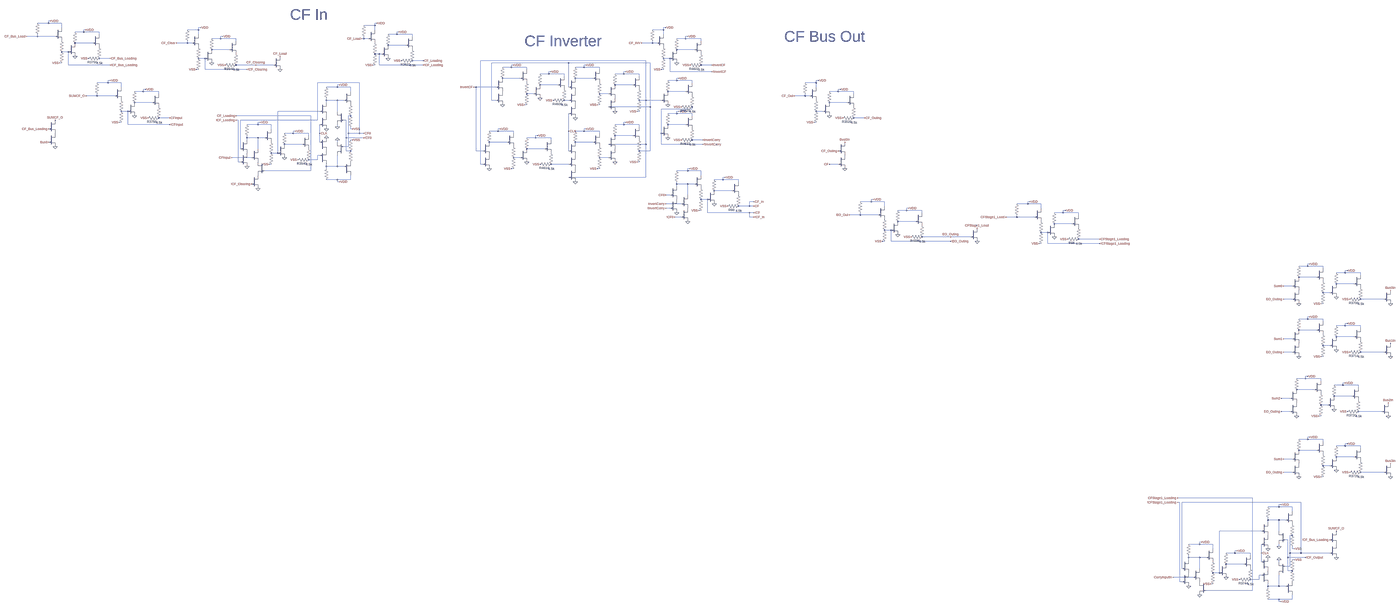
[diagram p0: schematic carry logic and bus outputting.asc, whole sheet]
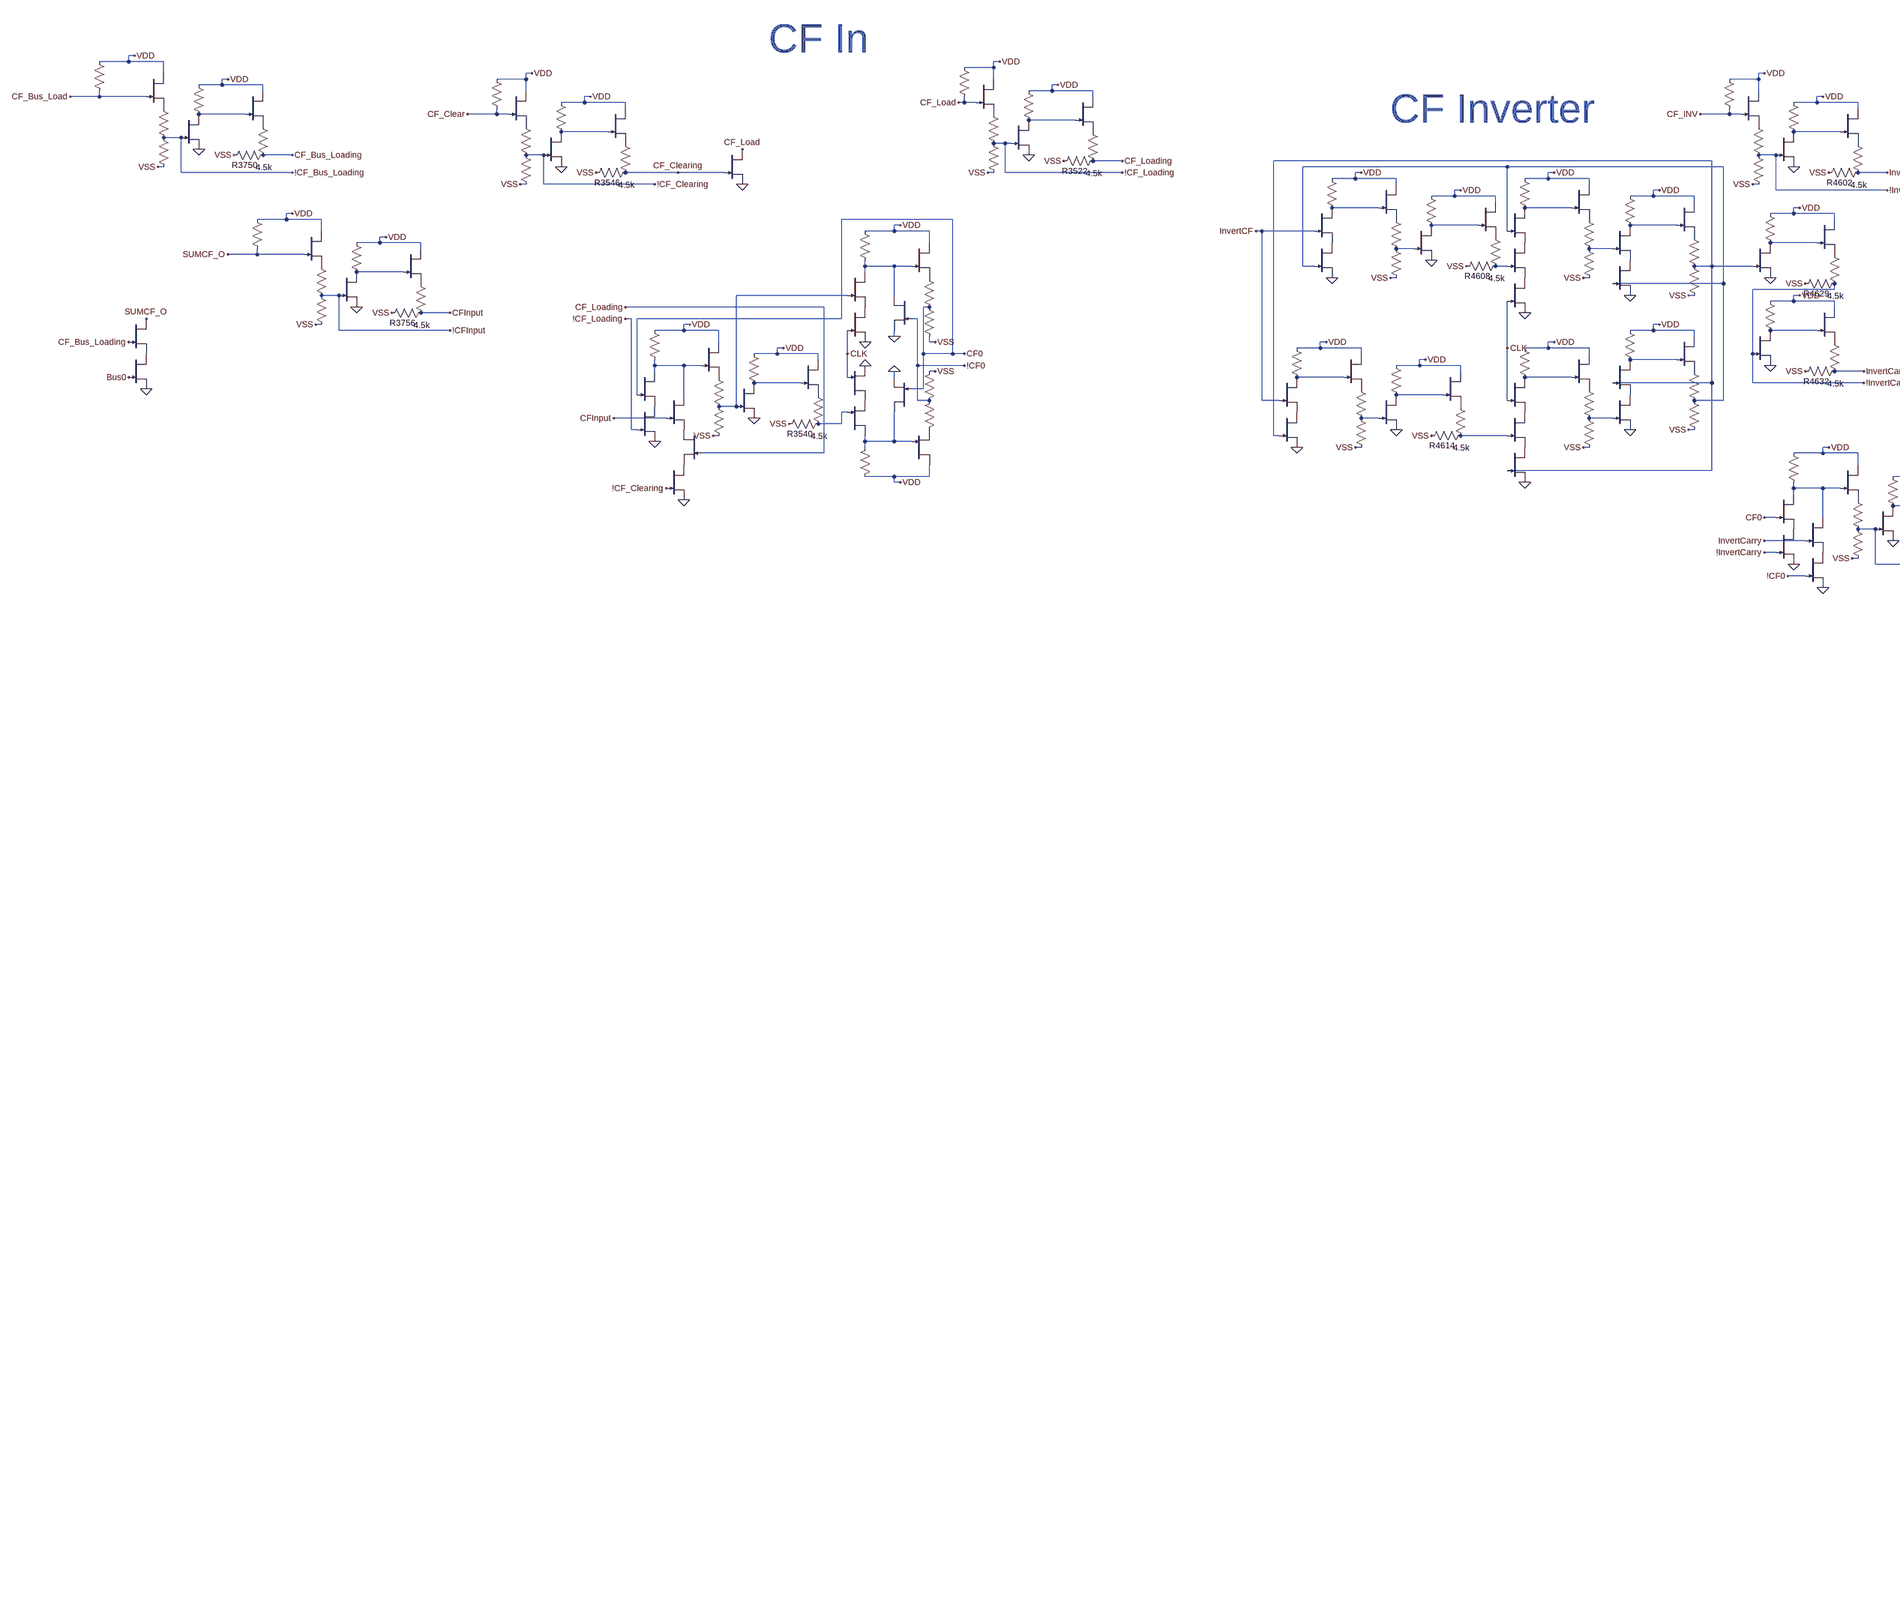
[diagram p1: schematic carry logic and bus outputting.asc, part, row 1 of 1, column 1 of 2]
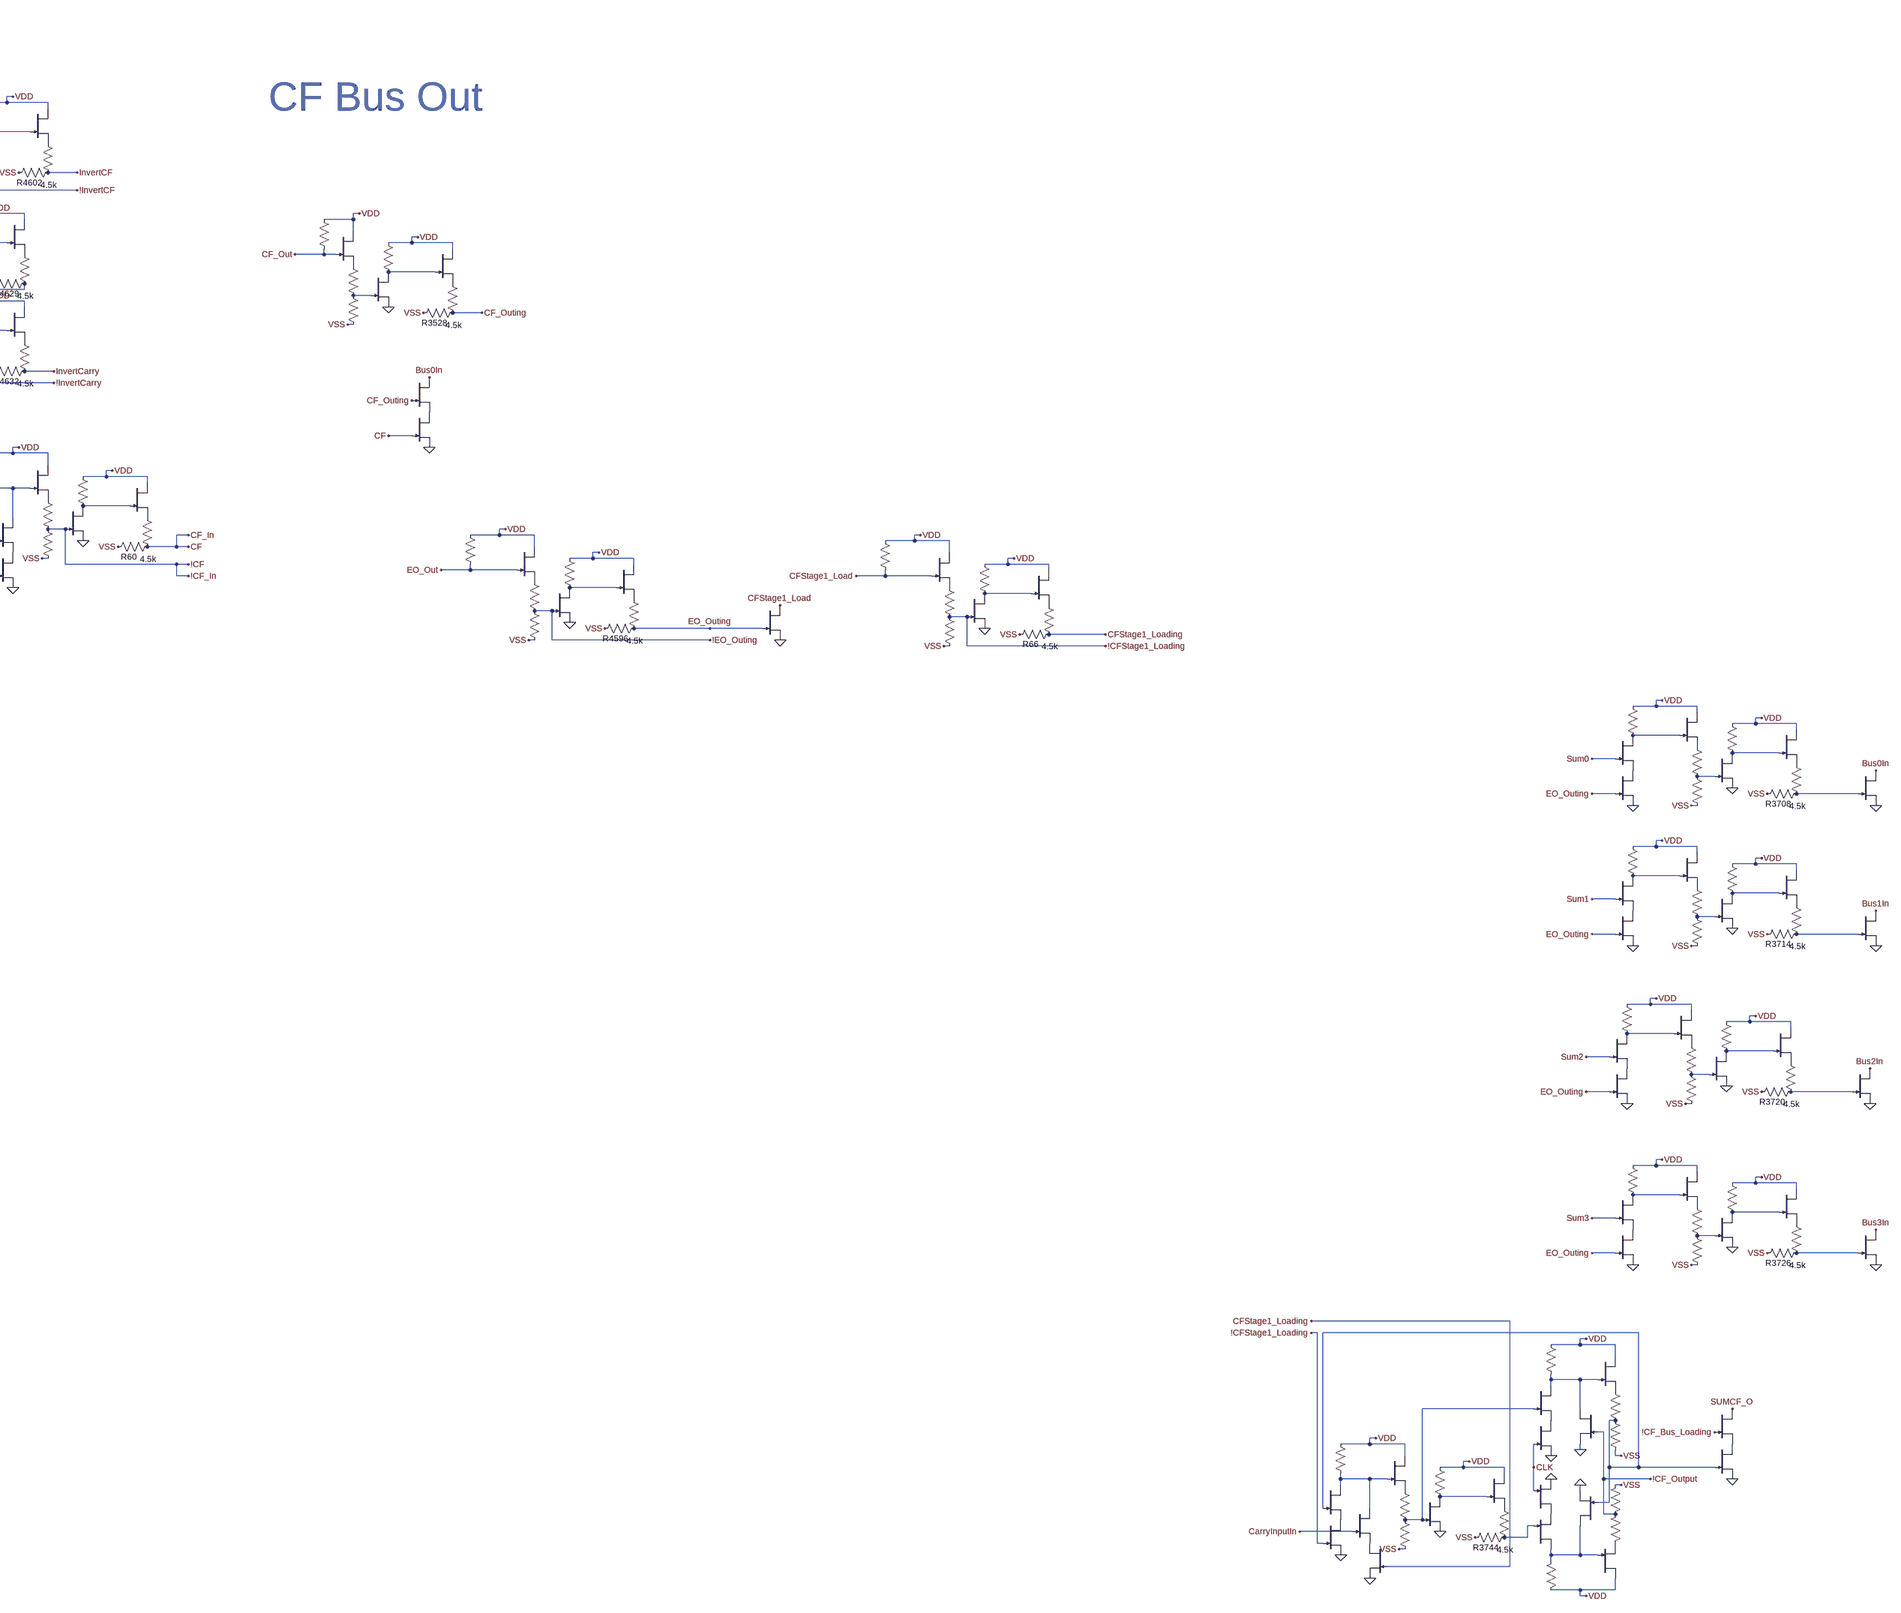
[diagram p2: schematic carry logic and bus outputting.asc, part, row 1 of 1, column 2 of 2]
* carry logic and bus outputting.asc
R3517 VDD CF_Load 100k
J_F895 VDD CF_Load P001 DR
R3518 P001 !CF_Loading 1k
R3519 !CF_Loading VSS 4.8k
J_A2167 N002 !CF_Loading 0 DR
R3520 VDD N002 50k
J_A2168 VDD N002 P002 DR
R3521 P002 CF_Loading 1k
R3522 CF_Loading VSS 4.5k
R3523 VDD CF_Out 100k
J_F896 VDD CF_Out P003 DR
R3524 P003 N019 1k
R3525 N019 VSS 4.8k
J_A2169 N017 N019 0 DR
R3526 VDD N017 50k
J_A2170 VDD N017 P004 DR
R3527 P004 CF_Outing 1k
R3528 CF_Outing VSS 4.5k
J_A2171 N014 N018 P005 DR
R3529 VDD N014 100k
J_F897 VDD N014 P006 DR
R3530 P006 CF0 1k
R3531 CF0 VSS 4.8k
J_B1018 N014 !CF0 0 DR
J_A2172 N031 N027 P007 DR
R3532 VDD N031 100k
J_F898 VDD N031 P008 DR
R3533 P008 !CF0 1k
R3534 !CF0 VSS 4.8k
J_B1019 N031 CF0 0 DR
J_A2173 P005 CLK 0 DR
J_A2174 P007 CLK 0 DR
J_A2175 N022 CF0 P009 DR
R3535 VDD N022 100k
J_F899 VDD N022 P010 DR
R3536 P010 N018 1k
R3537 N018 VSS 4.8k
J_B1020 N022 CFInput P011 DR
J_A2176 N025 N018 0 DR
R3538 VDD N025 50k
J_A2177 VDD N025 P012 DR
R3539 P012 N027 1k
R3540 N027 VSS 4.5k
J_A2178 P009 !CF_Loading 0 DR
J_B1021 P011 CF_Loading P013 DR
R3541 VDD CF_Clear 100k
J_F900 VDD CF_Clear P014 DR
R3542 P014 !CF_Clearing 1k
R3543 !CF_Clearing VSS 4.8k
J_A2179 N003 !CF_Clearing 0 DR
R3544 VDD N003 50k
J_A2180 VDD N003 P015 DR
R3545 P015 CF_Clearing 1k
R3546 CF_Clearing VSS 4.5k
J_A2181 P016 CF_In 0 DR
J_A2182 Bus0In CF_Outing P016 DR
J_B1022 CF_Load CF_Clearing 0 DR
J_B1023 P013 !CF_Clearing 0 DR
J_A2292 N036 Sum0 P017 DR
R3703 VDD N036 100k
J_F929 VDD N036 P018 DR
R3704 P018 N038 1k
R3705 N038 VSS 4.8k
J_B1083 P017 EO_Outing 0 DR
J_A2293 N037 N038 0 DR
R3706 VDD N037 50k
J_F930 VDD N037 P019 DR
R3707 P019 N039 1k
R3708 N039 VSS 4.5k
J_A2294 Bus0In N039 0 DR
J_A2295 N040 Sum1 P020 DR
R3709 VDD N040 100k
J_F931 VDD N040 P021 DR
R3710 P021 N042 1k
R3711 N042 VSS 4.8k
J_B1084 P020 EO_Outing 0 DR
J_A2296 N041 N042 0 DR
R3712 VDD N041 50k
J_F932 VDD N041 P022 DR
R3713 P022 N043 1k
R3714 N043 VSS 4.5k
J_A2297 Bus1In N043 0 DR
J_A2298 N044 Sum2 P023 DR
R3715 VDD N044 100k
J_F933 VDD N044 P024 DR
R3716 P024 N046 1k
R3717 N046 VSS 4.8k
J_B1085 P023 EO_Outing 0 DR
J_A2299 N045 N046 0 DR
R3718 VDD N045 50k
J_F934 VDD N045 P025 DR
R3719 P025 N047 1k
R3720 N047 VSS 4.5k
J_A2300 Bus2In N047 0 DR
J_A2301 N048 Sum3 P026 DR
R3721 VDD N048 100k
J_F935 VDD N048 P027 DR
R3722 P027 N050 1k
R3723 N050 VSS 4.8k
J_B1086 P026 EO_Outing 0 DR
J_A2302 N049 N050 0 DR
R3724 VDD N049 50k
J_F936 VDD N049 P028 DR
R3725 P028 N051 1k
R3726 N051 VSS 4.5k
J_A2303 Bus3In N051 0 DR
J_A2307 N053 N054 P029 DR
R3733 VDD N053 100k
J_F939 VDD N053 P030 DR
R3734 P030 N052 1k
R3735 N052 VSS 4.8k
J_B1089 N053 !CF_Output 0 DR
J_A2308 N058 N057 P031 DR
R3736 VDD N058 100k
J_F940 VDD N058 P032 DR
R3737 P032 !CF_Output 1k
R3738 !CF_Output VSS 4.8k
J_B1090 N058 N052 0 DR
J_A2309 P029 CLK 0 DR
J_A2310 P031 CLK 0 DR
J_A2311 N055 N052 P033 DR
R3739 VDD N055 100k
J_F941 VDD N055 P034 DR
R3740 P034 N054 1k
R3741 N054 VSS 4.8k
J_B1091 N055 CarryInputIn P035 DR
J_A2312 N056 N054 0 DR
R3742 VDD N056 50k
J_A2313 VDD N056 P036 DR
R3743 P036 N057 1k
R3744 N057 VSS 4.5k
J_A2314 P033 !CFStage1_Loading 0 DR
J_B1092 P035 CFStage1_Loading 0 DR
R3745 VDD CF_Bus_Load 100k
J_F942 VDD CF_Bus_Load P037 DR
R3746 P037 !CF_Bus_Loading 1k
R3747 !CF_Bus_Loading VSS 4.8k
J_A2315 N001 !CF_Bus_Loading 0 DR
R3748 VDD N001 50k
J_A2316 VDD N001 P038 DR
R3749 P038 CF_Bus_Loading 1k
R3750 CF_Bus_Loading VSS 4.5k
J_A2317 P039 N052 0 DR
J_A2318 SUMCF_O !CF_Bus_Loading P039 DR
J_A2319 SUMCF_O CF_Bus_Loading P040 DR
J_A2320 P040 Bus0 0 DR
R3751 VDD SUMCF_O 100k
J_F943 VDD SUMCF_O P041 DR
R3752 P041 !CFInput 1k
R3753 !CFInput VSS 4.8k
J_A2321 N016 !CFInput 0 DR
R3754 VDD N016 50k
J_A2322 VDD N016 P042 DR
R3755 P042 CFInput 1k
R3756 CFInput VSS 4.5k
R4591 VDD EO_Out 100k
J_F1212 VDD EO_Out P043 DR
R4592 P043 !EO_Outing 1k
R4593 !EO_Outing VSS 4.8k
J_A2658 N034 !EO_Outing 0 DR
R4594 VDD N034 50k
J_A2659 VDD N034 P044 DR
R4595 P044 EO_Outing 1k
R4596 EO_Outing VSS 4.5k
R4597 VDD CF_INV 100k
J_F1213 VDD CF_INV P045 DR
R4598 P045 !InvertCF 1k
R4599 !InvertCF VSS 4.8k
J_A2660 N004 !InvertCF 0 DR
R4600 VDD N004 50k
J_A2661 VDD N004 P046 DR
R4601 P046 InvertCF 1k
R4602 InvertCF VSS 4.5k
J_A2662 N007 InvertCF P047 DR
R4603 VDD N007 100k
J_F1214 VDD N007 P048 DR
R4604 P048 N012 1k
R4605 N012 VSS 4.8k
J_B1242 P047 N006 0 DR
J_A2663 N009 N012 0 DR
R4606 VDD N009 50k
J_F1215 VDD N009 P049 DR
R4607 P049 N015 1k
R4608 N015 VSS 4.5k
J_A2664 N023 InvertCF P050 DR
R4609 VDD N023 100k
J_F1216 VDD N023 P051 DR
R4610 P051 N028 1k
R4611 N028 VSS 4.8k
J_B1243 P050 N005 0 DR
J_A2665 N026 N028 0 DR
R4612 VDD N026 50k
J_F1217 VDD N026 P052 DR
R4613 P052 N030 1k
R4614 N030 VSS 4.5k
J_A2666 N008 N006 P053 DR
R4615 VDD N008 100k
J_F1218 VDD N008 P054 DR
R4616 P054 N013 1k
R4617 N013 VSS 4.8k
J_B1244 P053 N015 P055 DR
J_A2667 N024 CLK P056 DR
R4618 VDD N024 100k
J_F1219 VDD N024 P057 DR
R4619 P057 N029 1k
R4620 N029 VSS 4.8k
J_B1245 P056 N030 P058 DR
J_A2668 N010 N013 P059 DR
R4621 VDD N010 100k
J_F1220 VDD N010 P060 DR
R4622 P060 N005 1k
R4623 N005 VSS 4.8k
J_B1246 P059 N006 0 DR
J_A2669 N021 N005 P061 DR
R4624 VDD N021 100k
J_F1221 VDD N021 P062 DR
R4625 P062 N006 1k
R4626 N006 VSS 4.8k
J_B1247 P061 N029 0 DR
J_B1248 P055 CLK 0 DR
J_B1249 P058 N005 0 DR
J_A2670 N011 N005 0 DR
R4627 VDD N011 50k
J_F1222 VDD N011 P063 DR
R4628 P063 !InvertCarry 1k
R4629 !InvertCarry VSS 4.5k
J_A2671 N020 !InvertCarry 0 DR
R4630 VDD N020 50k
J_F1223 VDD N020 P064 DR
R4631 P064 InvertCarry 1k
R4632 InvertCarry VSS 4.5k
J_A39 N032 CF0 P065 DR
R55 VDD N032 100k
J_F10 VDD N032 P066 DR
R56 P066 !CF 1k
R57 !CF VSS 4.8k
J_B15 N032 InvertCarry P067 DR
J_A40 N033 !CF 0 DR
R58 VDD N033 50k
J_A41 VDD N033 P068 DR
R59 P068 CF_In 1k
R60 CF_In VSS 4.5k
J_A42 P065 !InvertCarry 0 DR
J_B16 P067 !CF0 0 DR
R61 VDD CFStage1_Load 100k
J_F11 VDD CFStage1_Load P069 DR
R62 P069 !CFStage1_Loading 1k
R63 !CFStage1_Loading VSS 4.8k
J_A43 N035 !CFStage1_Loading 0 DR
R64 VDD N035 50k
J_A44 VDD N035 P070 DR
R65 P070 CFStage1_Loading 1k
R66 CFStage1_Loading VSS 4.5k
J_A45 CFStage1_Load EO_Outing 0 DR
.model NJF NJF
.model PJF PJF
.lib standard.jft
* CF In
* CF Bus Out
* CF Inverter
.backanno
.end